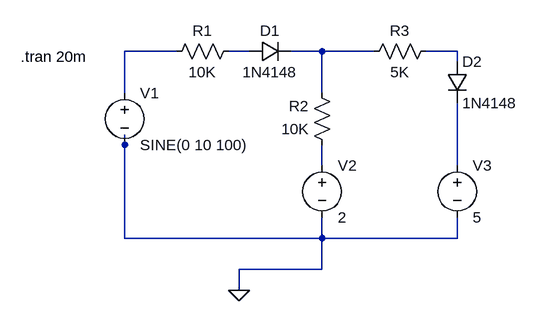
[diagram p0: schematic Draft2.asc]
Draft2.asc, the LTspice schematic file:
Version 4
SHEET 1 880 680
WIRE 48 112 -32 112
WIRE 160 112 128 112
WIRE 272 112 224 112
WIRE 352 112 272 112
WIRE 480 112 432 112
WIRE 480 128 480 112
WIRE -32 176 -32 112
WIRE 272 176 272 112
WIRE -32 256 -32 240
WIRE 272 288 272 256
WIRE 480 288 480 192
WIRE -32 400 -32 256
WIRE 272 400 272 368
WIRE 272 400 -32 400
WIRE 480 400 480 368
WIRE 480 400 272 400
WIRE 272 448 272 400
WIRE 272 448 144 448
WIRE 144 480 144 448
FLAG 144 480 0
SYMBOL voltage -32 160 R0
WINDOW 123 0 0 Left 0
WINDOW 39 0 0 Left 0
SYMATTR InstName V1
SYMATTR Value SINE(0 10 100)
SYMBOL res 144 96 R90
WINDOW 0 0 56 VBottom 2
WINDOW 3 32 56 VTop 2
SYMATTR InstName R1
SYMATTR Value 10K
SYMBOL res 288 272 R180
WINDOW 0 36 76 Left 2
WINDOW 3 36 40 Left 2
SYMATTR InstName R2
SYMATTR Value 10K
SYMBOL res 336 128 R270
WINDOW 0 32 56 VTop 2
WINDOW 3 0 56 VBottom 2
SYMATTR InstName R3
SYMATTR Value 5K
SYMBOL diode 160 128 R270
WINDOW 0 32 32 VTop 2
WINDOW 3 0 32 VBottom 2
SYMATTR InstName D1
SYMATTR Value 1N4148
SYMBOL diode 464 128 R0
SYMATTR InstName D2
SYMATTR Value 1N4148
SYMBOL voltage 272 272 R0
SYMATTR InstName V2
SYMATTR Value 2
SYMBOL voltage 480 272 R0
SYMATTR InstName V3
SYMATTR Value 5
TEXT -192 120 Left 2 !.tran 20m

The netlist it stands for:
* Draft2.asc
V1 N001 0 SINE(0 10 100)
R1 N002 N001 10K
R2 N005 N003 10K
R3 N003 N004 5K
D1 N002 N003 1N4148
D2 N004 N006 1N4148
V2 N005 0 2
V3 N006 0 5
.model D D
.lib standard.dio
.tran 20m
.backanno
.end